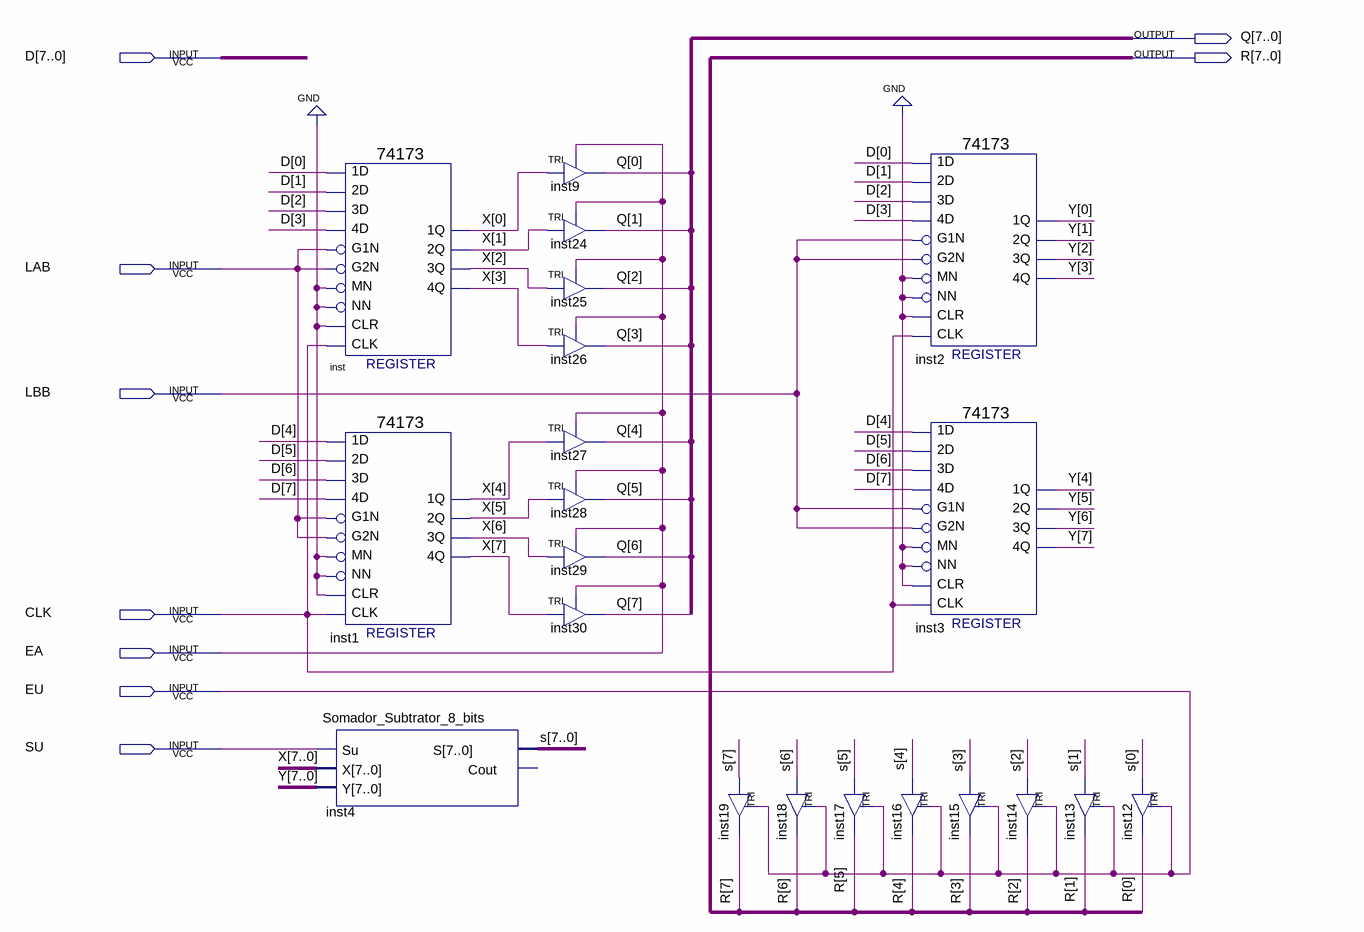
[diagram p0: schematic sheet]
// Quartus schematic ULA.bdf as structural Verilog: 21 symbols, 9 pins
module ULA (
  input  [7:0] D,
  input  LAB,
  input  LBB,
  input  CLK,
  input  EA,
  input  EU,
  input  SU,
  output [7:0] Q,
  output [7:0] R
);

  wire [7:0] s, X, Y;

  \74173  inst (
    .\3D (D[2]), .MN(1'b0), .\1D (D[0]), .\2D (D[1]), .\4D (D[3]), .G1N(LAB), .G2N(LAB), .NN(1'b0),
    .CLR(1'b0), .CLK(CLK), .\3Q (X[2]), .\2Q (X[1]), .\1Q (X[0]), .\4Q (X[3]));
  \74173  inst1 (
    .\3D (D[6]), .MN(1'b0), .\1D (D[4]), .\2D (D[5]), .\4D (D[7]), .G1N(LAB), .G2N(LAB), .NN(1'b0),
    .CLR(1'b0), .CLK(CLK), .\3Q (X[6]), .\2Q (X[5]), .\1Q (X[4]), .\4Q (X[7]));
  Somador_Subtrator_8_bits inst4 (.Su(SU), .X(X), .Y(Y), .S(s));  // open: Cout
  TRI inst9 (.IN(X[0]), .OE(EA), .OUT(Q[0]));
  TRI inst24 (.IN(X[1]), .OE(EA), .OUT(Q[1]));
  TRI inst25 (.IN(X[2]), .OE(EA), .OUT(Q[2]));
  TRI inst26 (.IN(X[3]), .OE(EA), .OUT(Q[3]));
  TRI inst27 (.IN(X[4]), .OE(EA), .OUT(Q[4]));
  TRI inst28 (.IN(X[5]), .OE(EA), .OUT(Q[5]));
  TRI inst29 (.IN(X[6]), .OE(EA), .OUT(Q[6]));
  TRI inst30 (.IN(X[7]), .OE(EA), .OUT(Q[7]));
  TRI inst19 (.IN(s[7]), .OE(EU), .OUT(R[7]));
  TRI inst17 (.IN(s[5]), .OE(EU), .OUT(R[5]));
  TRI inst18 (.IN(s[6]), .OE(EU), .OUT(R[6]));
  \74173  inst2 (
    .\3D (D[2]), .MN(1'b0), .\1D (D[0]), .\2D (D[1]), .\4D (D[3]), .G1N(LBB), .G2N(LBB), .NN(1'b0),
    .CLR(1'b0), .CLK(CLK), .\3Q (Y[2]), .\2Q (Y[1]), .\1Q (Y[0]), .\4Q (Y[3]));
  \74173  inst3 (
    .\3D (D[6]), .MN(1'b0), .\1D (D[4]), .\2D (D[5]), .\4D (D[7]), .G1N(LBB), .G2N(LBB), .NN(1'b0),
    .CLR(1'b0), .CLK(CLK), .\3Q (Y[6]), .\2Q (Y[5]), .\1Q (Y[4]), .\4Q (Y[7]));
  TRI inst16 (.IN(s[4]), .OE(EU), .OUT(R[4]));
  TRI inst15 (.IN(s[3]), .OE(EU), .OUT(R[3]));
  TRI inst13 (.IN(s[1]), .OE(EU), .OUT(R[1]));
  TRI inst14 (.IN(s[2]), .OE(EU), .OUT(R[2]));
  TRI inst12 (.IN(s[0]), .OE(EU), .OUT(R[0]));
endmodule
